# EAGLE design tx-warmer (EAGLE 6.5.0)
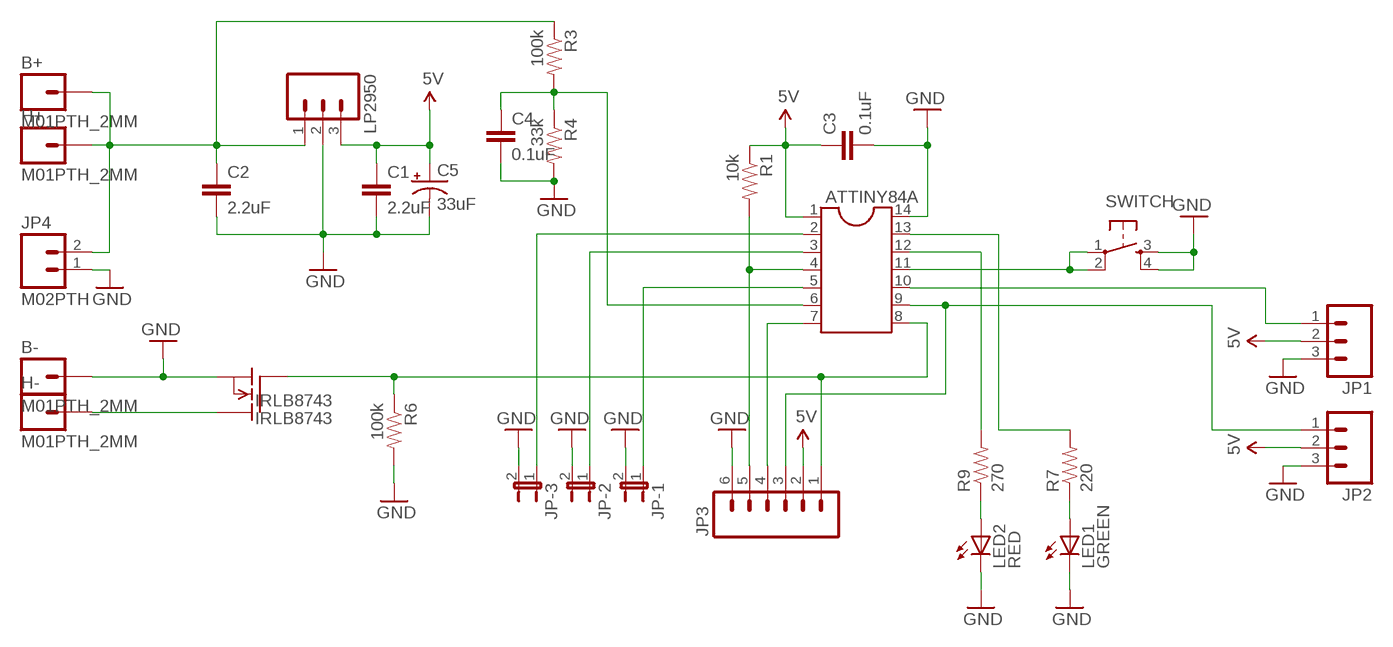
[diagram p0: schematic, sheet 1]

## Parts
ATTINY84A  DIL14S  [SOCKET-14]
B+  M01PTH_2MM  [1X01_2MM]
B-  M01PTH_2MM  [1X01_2MM]
C1  2.2uF  CAPPTH1  [CAP-PTH-5MM]
C2  2.2uF  CAPPTH1  [CAP-PTH-5MM]
C3  0.1uF  CAPEZ  [CAP-PTH-SMALLEZ]
C4  0.1uF  CAPEZ  [CAP-PTH-SMALLEZ]
C5  33uF  CAP_POLPTH2  [CPOL-RADIAL-10UF-25V]
H+  M01PTH_2MM  [1X01_2MM]
H-  M01PTH_2MM  [1X01_2MM]
IRLB8743  IRLB8743  IRF510  [TO220]
JP1  M03PTH  [1X03]
JP2  M03PTH  [1X03]
JP3  M06SIP  [1X06]
JP4  M02PTH  [1X02]
JP-1  JUMPER-2SMD-NO  [SJ_2S-NO]
JP-2  JUMPER-2SMD-NO  [SJ_2S-NO]
JP-3  JUMPER-2SMD-NO  [SJ_2S-NO]
LED1  GREEN  LED5MM-KIT  [LED5MM-KIT]
LED2  RED  LED5MM-KIT  [LED5MM-KIT]
LP2950  M031X03_NO_SILK  [1X03_NO_SILK]
R1  10k  RESISTOREZ  [AXIAL-0.3EZ]
R3  100k  RESISTOREZ  [AXIAL-0.3EZ]
R4  33k  RESISTOREZ  [AXIAL-0.3EZ]
R6  100k  RESISTOREZ  [AXIAL-0.3EZ]
R7  220  RESISTOREZ  [AXIAL-0.3EZ]
R9  270  RESISTOREZ  [AXIAL-0.3EZ]
SWITCH  TAC_SWITCHPTH  [TACTILE-PTH]

## Nets
5V: ATTINY84A.1 C1.1 C3.1 C5.1(+) JP1.2 JP2.2 JP3.2 LP2950.3 R1.P$1
GND: ATTINY84A.14 B-.1 C1.2 C2.2 C3.2 C4.2 C5.2(-) IRLB8743.3(S) JP1.3 JP2.3 JP3.6 JP4.1 JP-1.2 JP-2.2 JP-3.2 LED1.K(C) LED2.K(C) LP2950.2 R4.P$2 R6.P$2 SWITCH.3 SWITCH.4
N$1: ATTINY84A.9 JP2.1 JP3.3
N$2: ATTINY84A.7 JP3.4
N$3: ATTINY84A.10 JP1.1
N$4: B+.1 C2.1 H+.1 JP4.2 LP2950.1 R3.P$1
N$5: ATTINY84A.5 JP-1.1
N$6: ATTINY84A.8 IRLB8743.1(G) JP3.1 R6.P$1
N$7: ATTINY84A.6 C4.1 R3.P$2 R4.P$1
N$8: LED2.A R9.P$1
N$10: LED1.A R7.P$1
N$11: ATTINY84A.4 JP3.5 R1.P$2
N$12: ATTINY84A.12 R9.P$2
N$13: ATTINY84A.11 SWITCH.1 SWITCH.2
N$18: ATTINY84A.13 R7.P$2
N$19: H-.1 IRLB8743.2(D)
N$20: ATTINY84A.3 JP-2.1
N$21: ATTINY84A.2 JP-3.1

## Library data of the parts
ATTINY84A = ic-package:DIL14: Dual In Line / Socket
B+ B- H+ H- = SparkFun-Connectors:M01: Header 1 Standard 1-pin 0.1" header. Use with straight break away headers (SKU : PRT-00116), right angle break away headers (PRT-00553), swiss pins (PRT-00743), machine pins (PRT-00117), and female headers (PRT-00115).
C1-C4 = SparkFun-Passives:CAP: Capacitor Standard 0603 ceramic capacitor, and 0.1" leaded capacitor.
C5 = SparkFun-Capacitors:CAP_POL: Capacitor Polarized These are standard SMD and PTH capacitors. Normally 10uF, 47uF, and 100uF in electrolytic and tantalum varieties. Always verify the external diameter of the through hole cap, it varies with capacity, voltage, and manufacturer. The EIA devices should be standard.
IRLB8743 = transistor-fet:IRF510: N-Channel Enhancement MOSFET (HEXFET); 100V; 5,6A; 0,54Ohm
JP1 JP2 LP2950 = SparkFun-Connectors:M03: Header 3 Standard 3-pin 0.1" header. Use with straight break away headers (SKU : PRT-00116), right angle break away headers (PRT-00553), swiss pins (PRT-00743), machine pins (PRT-00117), and female headers (PRT-00115). Molex polarized connector foot print use with SKU : PRT-08232 with associated crimp pins and housings.
JP3 = SparkFun-Connectors:M06: Header 6 Standard 6-pin 0.1" header. Use with straight break away headers (SKU : PRT-00116), right angle break away headers (PRT-00553), swiss pins (PRT-00743), machine pins (PRT-00117), and female headers (PRT-00115). Molex polarized connector foot print use with SKU : PRT-08094 with associated crimp pins and housings. NOTES ON THE VARIANTS LOCK and LOCK_LONGPADS... This footprint was designed to help hold the alignment of a through-hole component (i.e. 6-pin header) while soldering it into place. You may notice that each hole has been shifted either up or down by 0.005 of an inch from it's more standard position (which is a perfectly straight line). This slight alteration caused the pins (the squares in the middle) to touch the edges of the holes. Because they are alternating, it causes a "brace" to hold the component in place. 0.005 has proven to be the perfect amount of "off-center" position when using our standard breakaway headers. Although looks a little odd when you look at the bare footprint, once you have a header in there, the alteration is very hard to notice. Also,if you push a header all the way into place, it is covered up entirely on the bottom side. This idea of altering the position of holes to aid alignment will be further integrated into the Sparkfun Library for other footprints. It can help hold any component with 3 or more connection pins.
JP4 = SparkFun-Connectors:M02: Standard 2-pin 0.1" header. Use with - straight break away headers ( PRT-00116) - right angle break away headers (PRT-00553) - swiss pins (PRT-00743) - machine pins (PRT-00117) - female headers (PRT-00115) Molex polarized connector foot print use with: PRT-08233 with associated crimp pins and housings. 2.54_SCREWTERM for use with PRT-10571. 3.5mm Screw Terminal footprints for PRT-08084 5mm Screw Terminal footprints for use with PRT-08433
JP-1-JP-3 = SparkFun-Passives:JUMPER-2: Jumper Basic 0.1" spaced jumper. Use with breakaway headers.
LED1 LED2 = SparkFun-LED:LED: LEDs Standard schematic elements and footprints for 5mm, 3mm, 1206, and 0603 sized LEDs. 5mm - Spark Fun Electronics SKU : COM-00529 (and others)
R1 R3 R4 R6 R7 R9 = SparkFun-Resistors:RESISTOR: Resistor Basic schematic elements and footprints for 0603, 1206, and PTH resistors.
SWITCH = SparkFun-Electromechanical:TAC_SWITCH: Momentary Switch Button commonly used for reset or general input. Spark Fun Electronics SKU : COM-00097

## Net classes
0 default: width 0.406 mm

## Board
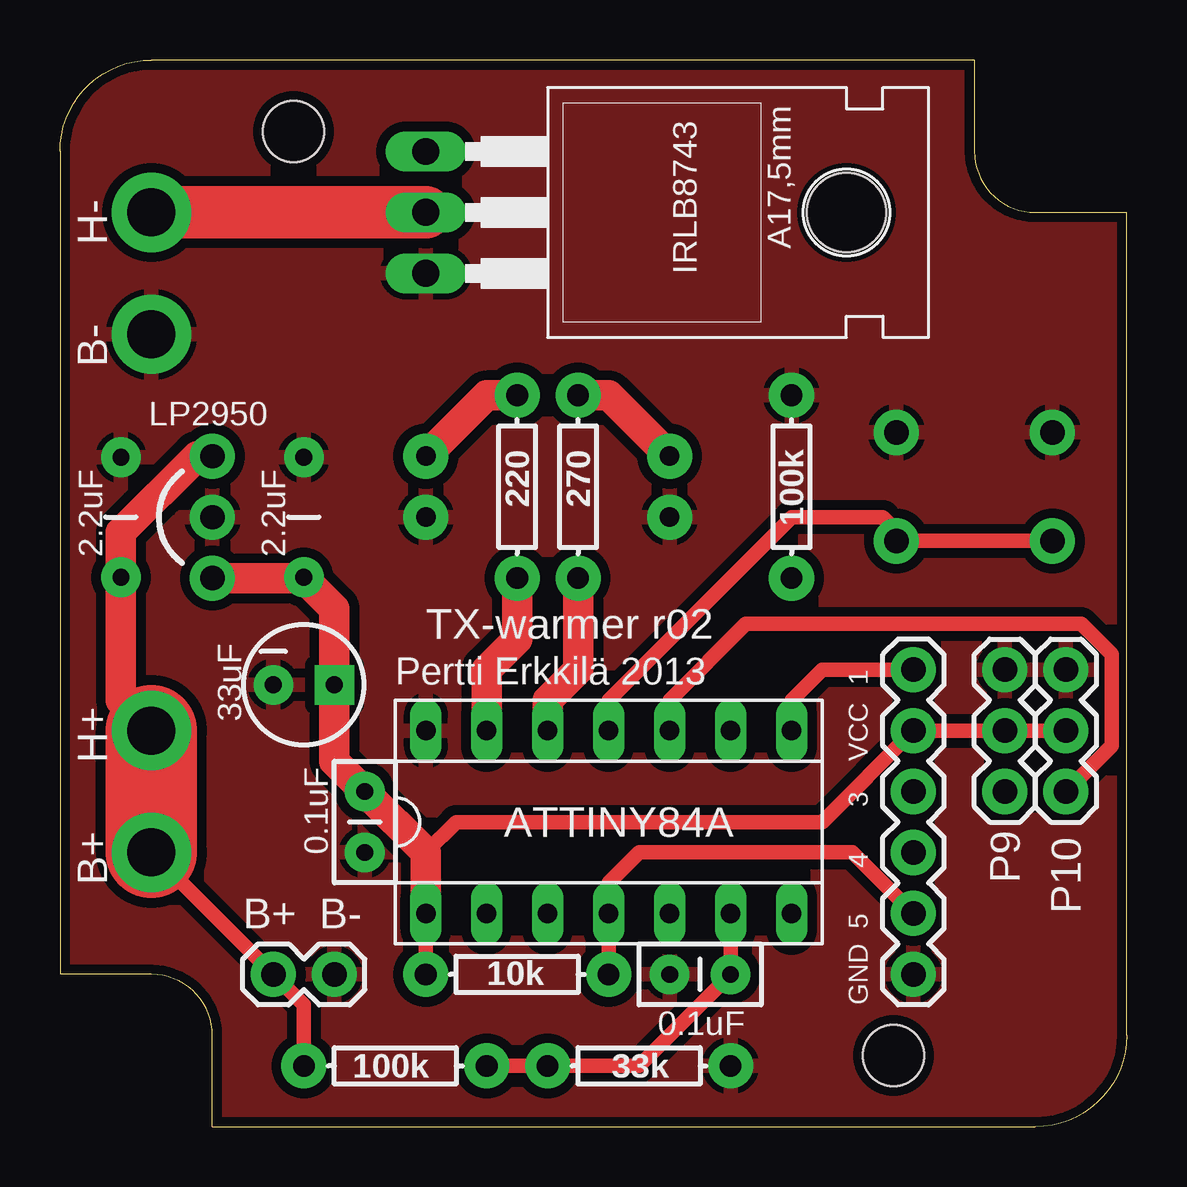
[diagram p1: board, top side]
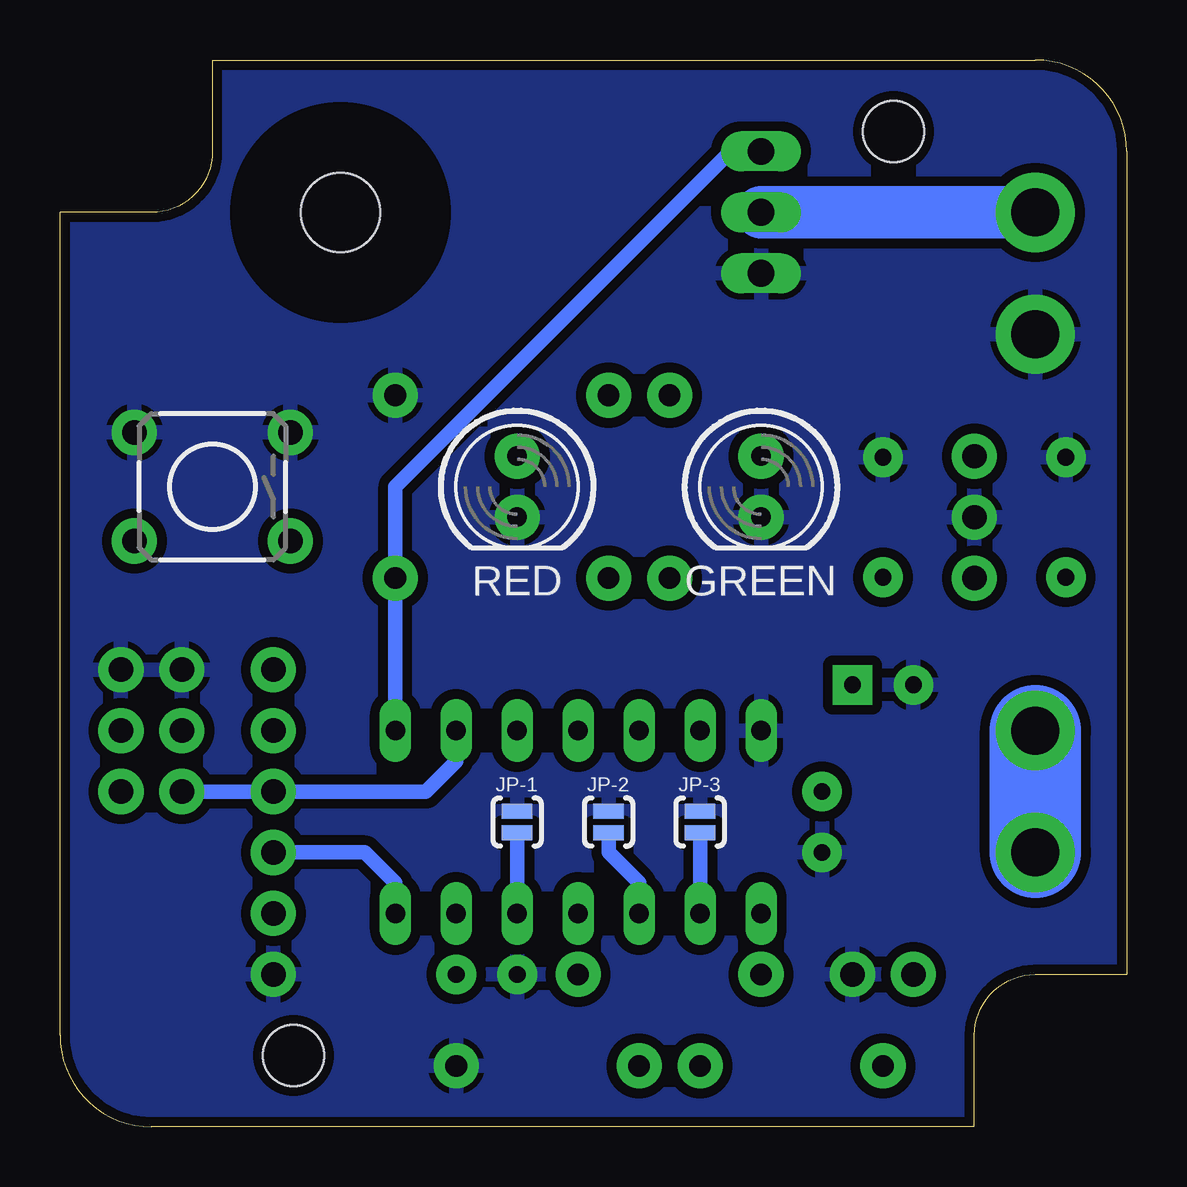
[diagram p2: board, bottom side, seen from below]

Size 44.45 x 44.45 mm. Coordinates in mm from the lower left corner, seen from the top.
Outline: 6.35,0 40.64,0 arc90 44.45,3.81 44.45,38.1 40.64,38.1 arc-90 38.1,40.64 38.1,44.45 3.81,44.45 arc90 0,40.64 0,6.35 3.81,6.35 arc-90 6.35,3.81 6.35,0
Copper layers (1*16): Top 0.035mm / dielectric 1.5mm / Bottom 0.035mm
Design rules "ITEADstudio_DRC": minimum track width 6mil, minimum drill 12mil, track to track 6mil, track to pad 6mil, pad to pad 6mil, via to via 6mil, smd to smd 0mil, copper to edge 10mil, drill to drill 10mil, minimum pad ring 10mil, minimum via ring 6mil, stop-mask expansion 2mil, vias tented up to drill 100mil, thermal gap 10mil
Holes 2.54 mm at 9.73,41.48 34.72,2.97

### Footprints (pad centres in the part's own frame; a part is rotated, then mirrored left to right if it is on the bottom)
SOCKET-14 = drill 0.813 long: 1 -7.62,-3.81; 2 -5.08,-3.81; 3 -2.54,-3.81; 4 0,-3.81; 5 2.54,-3.81; 6 5.08,-3.81; 7 7.62,-3.81; 8 7.62,3.81; 9 5.08,3.81; 10 2.54,3.81; 11 0,3.81; 12 -2.54,3.81; 13 -5.08,3.81; 14 -7.62,3.81
1X01_2MM = drill 2 pad 3.302: 1 0,0
CAP-PTH-5MM = drill 0.7 pad 1.651: 1 -2.5,0; 2 2.5,0
CAP-PTH-SMALLEZ = drill 0.7 pad 1.651: 1 0,0; 2 2.54,0
CPOL-RADIAL-10UF-25V = drill 0.7 pad 1.651 square: 1 1.27,0 | drill 0.7 pad 1.651: 2 -1.27,0
TO220 = drill 1.118 long: 1 -2.54,-6.35; 2 0,-6.35; 3 2.54,-6.35 | hole 3.302: 0,11.176
1X03 = drill 1.016 pad 1.88: 1 0,0; 2 2.54,0; 3 5.08,0
1X06 = drill 1.016 pad 1.88: 1 0,0; 2 2.54,0; 3 5.08,0; 4 7.62,0; 5 10.16,0; 6 12.7,0
1X02 = drill 1.016 pad 1.88: 1 0,0; 2 2.54,0
SJ_2S-NO = smd 0.635 x 1.27: 1 -0.45,0; 2 0.45,0
LED5MM-KIT = drill 0.813 pad 1.88: A -1.27,0; K 1.27,0
1X03_NO_SILK = drill 1.016 pad 1.88: 1 0,0; 2 2.54,0; 3 5.08,0
AXIAL-0.3EZ = drill 0.9 pad 1.88: P$1 -3.81,0; P$2 3.81,0
TACTILE-PTH = drill 1.016 pad 1.88: 1 -3.251,2.261; 2 3.251,2.261; 3 -3.251,-2.261; 4 3.251,-2.261

### Placement (x,y rotation side)
ATTINY84A  22.86,12.7 0 top
B+  3.81,11.43 0 top
B-  3.81,33.02 0 top
C1  10.16,25.4 90 top
C2  2.54,25.4 90 top
C3  12.7,13.97 270 top
C4  27.94,6.35 180 top
C5  10.16,18.41 0 top
H+  3.81,16.51 0 top
H-  3.81,38.1 0 top
IRLB8743  21.59,38.1 270 top
JP1  41.91,13.97 90 top
JP2  39.37,13.97 90 top
JP3  35.56,19.05 270 top
JP4  11.43,6.35 180 top
JP-1  25.4,12.7 90 bottom
JP-2  21.59,12.7 90 bottom
JP-3  17.78,12.7 90 bottom
LED1  15.24,26.67 270 bottom
LED2  25.4,26.67 270 bottom
LP2950  6.35,27.94 270 top
R1  19.05,6.35 0 top
R3  13.97,2.54 0 top
R4  24.13,2.54 0 top
R6  30.48,26.67 90 top
R7  19.05,26.67 270 top
R9  21.59,26.67 270 top
SWITCH  38.1,26.67 180 bottom

### Tracks (layer width: path | path; a pad name or v marks a point on that pad's centre or on a via)
5V
  Top 0.61: R1.P$1 ATTINY84A.1 | 15.24,11.43 16.51,12.7 31.75,12.7 JP3.2 JP2.2 JP1.2
  Top 1.27: ATTINY84A.1 15.24,11.43 C3.1 11.43,15.24 C5.1 11.43,21.59 10.16,22.86 | LP2950.3 10.16,22.86 | C1.1 10.16,22.86
GND
  pour Bottom (isolate 0.406): -1.27,-1.27 -1.27,45.72 45.72,45.72 45.72,-1.27
  pour Top (isolate 0.406): -2.54,46.99 46.99,46.99 46.99,-2.54 -2.54,-2.54
N$1
  Bottom 0.61: ATTINY84A.9 27.94,15.24 29.21,13.97 JP3.3 JP2.1
N$2
  Bottom 0.61: ATTINY84A.7 30.48,10.16 31.75,11.43 JP3.4
N$3
  Top 0.61: ATTINY84A.10 25.4,17.78 28.57,20.95 42.55,20.95 43.82,19.68 43.82,15.88 JP1.1
N$4
  Top 0.61: B+.1 JP4.2 10.16,5.08 R3.P$1
  Top 1.27: LP2950.1 5.71,27.94 2.54,24.77 C2.1 2.54,17.78 H+.1
  Top 3.81: B+.1 H+.1
  Bottom 3.81: B+.1 H+.1
N$5
  Bottom 0.61: JP-1.1 ATTINY84A.5
N$6
  Top 0.61: ATTINY84A.8 30.48,17.78 31.75,19.05 JP3.1
  Bottom 0.61: ATTINY84A.8 R6.P$1 30.48,26.67 16.51,40.64 IRLB8743.1
N$7
  Top 0.61: R3.P$2 R4.P$1 24.13,2.54 C4.1 ATTINY84A.6
N$8
  Top 1.27: R9.P$1 22.86,30.48 LED2.A
N$10
  Top 1.27: R7.P$1 17.78,30.48 LED1.A
N$11
  Top 0.61: R1.P$2 ATTINY84A.4 22.86,10.16 24.13,11.43 33.02,11.43 JP3.5
N$12
  Top 1.27: R9.P$2 21.59,19.05 20.32,17.78 ATTINY84A.12
N$13
  Top 0.61: SWITCH.2 SWITCH.1 34.85,24.84 34.29,25.4 30.48,25.4 22.86,17.78 ATTINY84A.11
N$18
  Top 1.27: ATTINY84A.13 17.78,19.05 19.05,20.32 R7.P$2
N$19
  Top 2.184: IRLB8743.2 H-.1
  Bottom 2.184: IRLB8743.2 H-.1
N$20
  Bottom 0.61: ATTINY84A.3 20.32,10.16 21.59,11.43 JP-2.1
N$21
  Bottom 0.61: JP-3.1 ATTINY84A.2

### Text on the board
tPlace: TX-warmer r02 | Pertti Erkkilä 2013
tNames: 1 | VCC | 3 | 4 | P9 | P10 | B+ | B- | 5 | GND